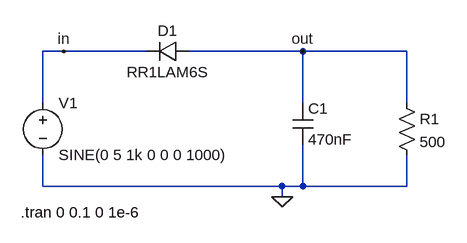
[diagram p0: schematic Draft2.asc]
Draft2.asc, the LTspice schematic file:
Version 4
SHEET 1 880 680
WIRE -16 96 -48 96
WIRE 112 96 -16 96
WIRE 352 96 176 96
WIRE 512 96 352 96
WIRE -48 176 -48 96
WIRE 352 176 352 96
WIRE 512 176 512 96
WIRE -48 304 -48 256
WIRE 320 304 -48 304
WIRE 352 304 352 240
WIRE 352 304 320 304
WIRE 512 304 512 256
WIRE 512 304 352 304
WIRE 320 320 320 304
FLAG 320 320 0
FLAG -16 96 in
FLAG 352 96 out
SYMBOL voltage -48 160 R0
WINDOW 123 0 0 Left 0
WINDOW 39 0 0 Left 0
SYMATTR InstName V1
SYMATTR Value SINE(0 5 1k 0 0 0 1000)
SYMBOL diode 176 80 R90
WINDOW 0 0 32 VBottom 2
WINDOW 3 32 32 VTop 2
SYMATTR InstName D1
SYMATTR Value RR1LAM6S
SYMBOL cap 336 176 R0
SYMATTR InstName C1
SYMATTR Value 470nF
SYMBOL res 496 160 R0
SYMATTR InstName R1
SYMATTR Value 500
TEXT -82 344 Left 2 !.tran 0 0.1 0 1e-6

The netlist it stands for:
* Draft2.asc
V1 in 0 SINE(0 5 1k 0 0 0 1000)
D1 out in RR1LAM6S
C1 out 0 470nF
R1 out 0 500
.model D D
.lib standard.dio
.tran 0 0.1 0 1e-6
.backanno
.end